# EAGLE design memtester (EAGLE 9.6.2)
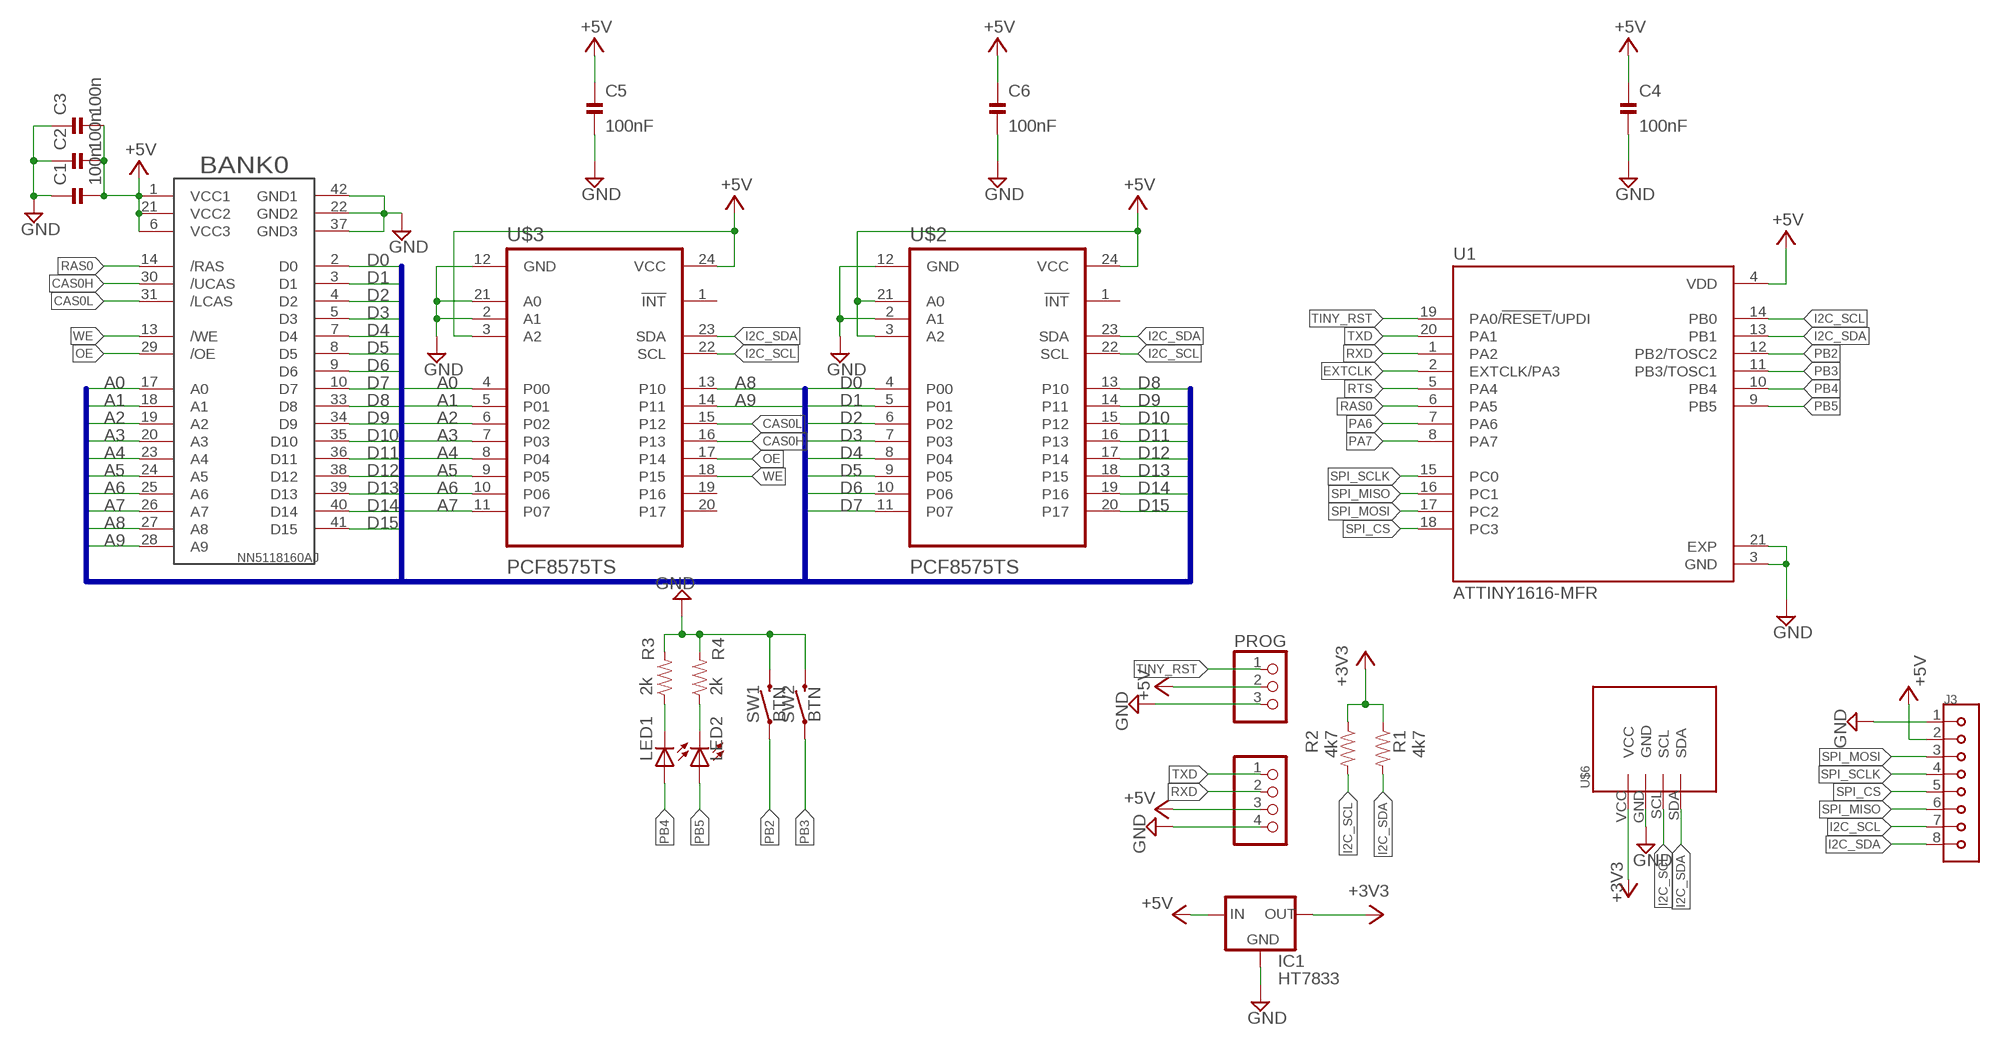
[diagram p0: schematic, sheet 1]

## Parts
C1  100n  CAPACITOR0402_CAP  [0402_CAP]
C2  100n  CAPACITOR0402_CAP  [0402_CAP]
C3  100n  CAPACITOR0402_CAP  [0402_CAP]
C4  100nF  CAPACITOR0402_CAP  [0402_CAP]
C5  100nF  CAPACITOR0402_CAP  [0402_CAP]
C6  100nF  CAPACITOR0402_CAP  [0402_CAP]
IC1  HT7833  HT7333  [SOT-89]
J3  SM08B-SRSS-TB(LF)(SN)  [JST_SM08B-SRSS-TB(LF)(SN)]
LED1  green  LEDCHIP-LED0805  [CHIP-LED0805]
LED2  green  LEDCHIP-LED0805  [CHIP-LED0805]
PROG  PINHD-1X3  [1X03]
R1  4k7  RESISTOR0402_RES  [0402_RES]
R2  4k7  RESISTOR0402_RES  [0402_RES]
R3  2k  RESISTOR0402_RES  [0402_RES]
R4  2k  RESISTOR0402_RES  [0402_RES]
SW1  BTN  MOMENTARY-SWITCH-SPST-SMD-6.0X3.5MM  [TACTILE_SWITCH_SMD_6.0X3.5MM]
SW2  BTN  MOMENTARY-SWITCH-SPST-SMD-6.0X3.5MM  [TACTILE_SWITCH_SMD_6.0X3.5MM]
U1  ATTINY1616-MFR  [QFN40P300X300X90-21N]
U$1  NN5118160AJSOCKET  [SOJ42SOCKET]
U$2  PCF8575TS  [SSOP24]
U$3  PCF8575TS  [SSOP24]
U$6  OLED_0.96_I2CNO_DRILL  [OLED_0.96_I2C_NO_DRILL]
UART  PINHD-1X4  [1X04]

## Nets
+3V3: IC1.1(OUT) R1.1 R2.1 U$6.VCC
+5V: C1.2 C2.2 C3.2 C4.1 C5.1 C6.1 IC1.3(IN) IC1.4(IN) J3.2 PROG.2 U1.4(VDD) U$1.1(VCC1) U$1.6(VCC3) U$1.21(VCC2) U$2.3(A2) U$2.21(A0) U$2.24(VCC) U$3.3(A2) U$3.24(VCC) UART.3
A0: U$1.17(A0) U$3.4(P00)
A1: U$1.18(A1) U$3.5(P01)
A2: U$1.19(A2) U$3.6(P02)
A3: U$1.20(A3) U$3.7(P03)
A4: U$1.23(A4) U$3.8(P04)
A5: U$1.24(A5) U$3.9(P05)
A6: U$1.25(A6) U$3.10(P06)
A7: U$1.26(A7) U$3.11(P07)
A8: U$1.27(A8) U$3.13(P10)
A9: U$1.28(A9) U$3.14(P11)
CAS0H: U$1.30(/UCAS) U$3.16(P13)
CAS0L: U$1.31(/LCAS) U$3.15(P12)
D0: U$1.2(D0) U$2.4(P00)
D1: U$1.3(D1) U$2.5(P01)
D2: U$1.4(D2) U$2.6(P02)
D3: U$1.5(D3) U$2.7(P03)
D4: U$1.7(D4) U$2.8(P04)
D5: U$1.8(D5) U$2.9(P05)
D6: U$1.9(D6) U$2.10(P06)
D7: U$1.10(D7) U$2.11(P07)
D8: U$1.33(D8) U$2.13(P10)
D9: U$1.34(D9) U$2.14(P11)
D10: U$1.35(D10) U$2.15(P12)
D11: U$1.36(D11) U$2.16(P13)
D12: U$1.38(D12) U$2.17(P14)
D13: U$1.39(D13) U$2.18(P15)
D14: U$1.40(D14) U$2.19(P16)
D15: U$1.41(D15) U$2.20(P17)
EXTCLK: U1.2(EXTCLK/PA3)
GND: C1.1 C2.1 C3.1 C4.2 C5.2 C6.2 IC1.2(GND) J3.1 PROG.3 R3.2 R4.2 SW1.2 SW2.2 U1.3(GND) U1.21(EXP) U$1.22(GND2) U$1.37(GND3) U$1.42(GND1) U$2.2(A1) U$2.12(GND) U$3.2(A1) U$3.12(GND) U$3.21(A0) U$6.GND UART.4
I2C_SCL: J3.7 R2.2 U1.14(PB0) U$2.22(SCL) U$3.22(SCL) U$6.SCL
I2C_SDA: J3.8 R1.2 U1.13(PB1) U$2.23(SDA) U$3.23(SDA) U$6.SDA
N$2: LED1.C R3.1
N$3: LED2.C R4.1
OE: U$1.29(/OE) U$3.17(P14)
PA6: U1.7(PA6)
PA7: U1.8(PA7)
PB2: SW1.1 U1.12(PB2/TOSC2)
PB3: SW2.1 U1.11(PB3/TOSC1)
PB4: LED1.A U1.10(PB4)
PB5: LED2.A U1.9(PB5)
RAS0: U1.6(PA5) U$1.14(/RAS)
RTS: U1.5(PA4)
RXD: U1.1(PA2) UART.2
SPI_CS: J3.5 U1.18(PC3)
SPI_MISO: J3.6 U1.16(PC1)
SPI_MOSI: J3.3 U1.17(PC2)
SPI_SCLK: J3.4 U1.15(PC0)
TINY_RST: PROG.1 U1.19(PA0/!RESET!/UPDI)
TXD: U1.20(PA1) UART.1
WE: U$1.13(/WE) U$3.18(P15)
Unconnected: U$2.1(!INT) U$3.1(!INT) U$3.19(P16) U$3.20(P17)

## Buses
A0,A1,A2,A3,A4,A5,A6,A7,A8,A9,D0,D1,D2,D3,D4,D5,D6,D7,D8,D9,D10,D11,D12,D13,D14,D15

## Notes on the sheet
- BANK0

## Library data of the parts
C1-C6 = passives:CAPACITOR: SMD Capacitor
IC1 = holtek2:HT73*; LCSC_PART: C50936
J3 = SM08B-SRSS-TB_LF__SN_:SM08B-SRSS-TB(LF)(SN): SH Series 8 Position 1 mm Pitch Surface Mount Side Entry Shrouded Header Check availability <https://pricing.snapeda.com/parts/SM08B-SRSS-TB%28LF%29%28SN%29/JST%20Sales/view-part?ref=eda>; AVAILABILITY: In Stock; DESCRIPTION: Connector Header Surface Mount, Right Angle 8 position 0.039 (1.00mm); LCSC_PART: C160407; MF: JST Sales; MP: SM08B-SRSS-TB(LF)(SN); PACKAGE: None; PRICE: None; PURCHASE-URL: https://pricing.snapeda.com/search/part/SM08B-SRSS-TB(LF)(SN)/?ref=eda
LED1 LED2 = led:LED: LED OSRAM: - CHIPLED LG R971, LG N971, LY N971, LG Q971, LY Q971, LO R971, LY R971 LH N974, LH R974 LS Q976, LO Q976, LY Q976 LO Q996 - Hyper CHIPLED LW Q18S LB Q993, LB Q99A, LB R99A - SideLED LS A670, LO A670, LY A670, LG A670, LP A670 LB A673, LV A673, LT A673, LW A673 LH A674 LY A675 LS A676, LA A676, LO A676, LY A676, LW A676 LS A679, LY A679, LG A679 - Hyper Micro SIDELED® LS Y876, LA Y876, LO Y876, LY Y876 LT Y87S - SmartLED LW L88C, LW L88S LB L89C, LB L89S, LG L890 LS L89K, LO L89K, LY L89K LS L896, LA L896, LO L896, LY L896 - TOPLED LS T670, LO T670, LY T670, LG T670, LP T670 LSG T670, LSP T670, LSY T670, LOP T670, LYG T670 LG T671, LOG T671, LSG T671 LB T673, LV T673, LT T673, LW T673 LH T674 LS T676, LA T676, LO T676, LY T676, LB T676, LH T676, LSB T676, LW T676 LB T67C, LV T67C, LT T67C, LS T67K, LO T67K, LY T67K, LW E67C LS E67B, LA E67B, LO E67B, LY E67B, LB E67C, LV E67C, LT E67C LW T67C LS T679, LY T679, LG T679 LS T770, LO T770, LY T770, LG T770, LP T770 LB T773, LV T773, LT T773, LW T773 LH T774 LS E675, LA E675, LY E675, LS T675 LS T776, LA T776, LO T776, LY T776, LB T776 LHGB T686 LT T68C, LB T68C - Hyper Mini TOPLED® LB M676 - Mini TOPLED Santana® LG M470 LS M47K, LO M47K, LY M47K Source: http://www.osram.convergy.de LUXEON: - LUMILED® LXK2-PW12-R00, LXK2-PW12-S00, LXK2-PW14-U00, LXK2-PW14-V00 LXK2-PM12-R00, LXK2-PM12-S00, LXK2-PM14-U00 LXK2-PE12-Q00, LXK2-PE12-R00, LXK2-PE12-S00, LXK2-PE14-T00, LXK2-PE14-U00 LXK2-PB12-K00, LXK2-PB12-L00, LXK2-PB12-M00, LXK2-PB14-N00, LXK2-PB14-P00, LXK2-PB14-Q00 LXK2-PR12-L00, LXK2-PR12-M00, LXK2-PR14-Q00, LXK2-PR14-R00 LXK2-PD12-Q00, LXK2-PD12-R00, LXK2-PD12-S00 LXK2-PH12-R00, LXK2-PH12-S00 LXK2-PL12-P00, LXK2-PL12-Q00, LXK2-PL12-R00 Source: www.luxeon.com KINGBRIGHT: KA-3528ASYC Source: www.kingbright.com; LCSC_PART: C2297
PROG = pinhead:PINHD-1X3: PIN HEADER
R1-R4 = passives:RESISTOR: Resistor Basic schematic elements and footprints for 0201, 0402, 0603, 1206, and PTH resistors.
SW1 SW2 = SparkFun-Switches:MOMENTARY-SWITCH-SPST: Momentary Switch (Pushbutton) - SPST Normally-open (NO) SPST momentary switches (buttons, pushbuttons). Variants PTH-12MM - 12mm square, through-hole Momentary Pushbutton Switch - 12mm Square <https://www.sparkfun.com/products/9190> (COM-09190) PTH-6.0MM, PTH-6.0MM-KIT - 6.0mm square, through-hole Mini Pushbutton Switch <https://www.sparkfun.com/products/97> (COM-00097) KIT package intended for soldering kit's - only one side of pads' copper is exposed. PTH-RIGHT-ANGLE-KIT - Right-angle, through-hole Right Angle Tactile Button <https://www.sparkfun.com/products/10791> - Used on SparkFun BigTime Watch Kit <https://www.sparkfun.com/products/11734> SMD-12MM - 12mm square, surface-mount Tactile Button - SMD (12mm) <https://www.sparkfun.com/products/12993> (COM-12993) Used on SparkFun PicoBoard <https://www.sparkfun.com/products/11888> SMD-4.5MM - 4.5mm Square Trackball Switch Used on SparkFun Blackberry Trackballer Breakout <https://www.sparkfun.com/products/13169> SMD-4.6MMX2.8MM - 4.60mm x 2.80mm, surface mount Used on SparkFun SAMD21 Mini Breakout <https://www.sparkfun.com/products/13664> SMD-5.2MM, SMD-5.2-REDUNDANT - 5.2mm square, surface-mount Mini Pushbutton Switch - SMD <https://www.sparkfun.com/products/8720> (COM-08720) Used on Arduino Pro Mini <https://www.sparkfun.com/products/11114> REDUNDANT package connects both switch circuits together SMD-6.0X3.5MM - 6.0 x 3.5mm, surface mount Momentary Reset Switch SMD <https://www.sparkfun.com/products/8229> (COM-08229) SMD-6.2MM-TALL - 6.2mm square, surface mount Tactile Button - SMD (6mm) <https://www.sparkfun.com/products/12992> Used on SparkFun Digital Sandbox <https://www.sparkfun.com/products/12651> SMD-RIGHT-ANGLE - Right-angle, surface mount Used on SparkFun Block for Intel® Edison - Arduino <https://www.sparkfun.com/products/13036>; LCSC_PART: C118141; PROD_ID: SWCH-00815; SF_SKU: COM-08229
U1 = ATTINY1616-MFR:ATTINY1616-MFR: AVR tinyAVR 1, Functional Safety (FuSa) Microcontroller IC 8-Bit 16MHz 16KB (16K x 8) FLASH 20-VQFN (3x3) Check availability <https://pricing.snapeda.com/parts/ATTINY1616-MFR/Microchip/view-part?ref=eda>; AVAILABILITY: In Stock; DESCRIPTION: AVR tinyAVR™ 1, Functional Safety (FuSa) Microcontroller IC 8-Bit 16MHz 16KB (16K x 8) FLASH 20-VQFN (3x3); MF: Microchip; MP: ATTINY1616-MFR; PACKAGE: VQFN-20 Microchip; PRICE: None; PURCHASE-URL: https://pricing.snapeda.com/search/part/ATTINY1616-MFR/?ref=eda
U$1 = memory:NN5118160AJ
U$2 U$3 = PCF8575TS:PCF8575TS; LCSC_PART: C12251
U$6 = tft_1_8_1_44_oled_0_96:OLED_0.96_I2C
UART = pinhead:PINHD-1X4: PIN HEADER

## Net classes
0 default: width 0.152 mm
1 supply: width 0.635 mm

## Board
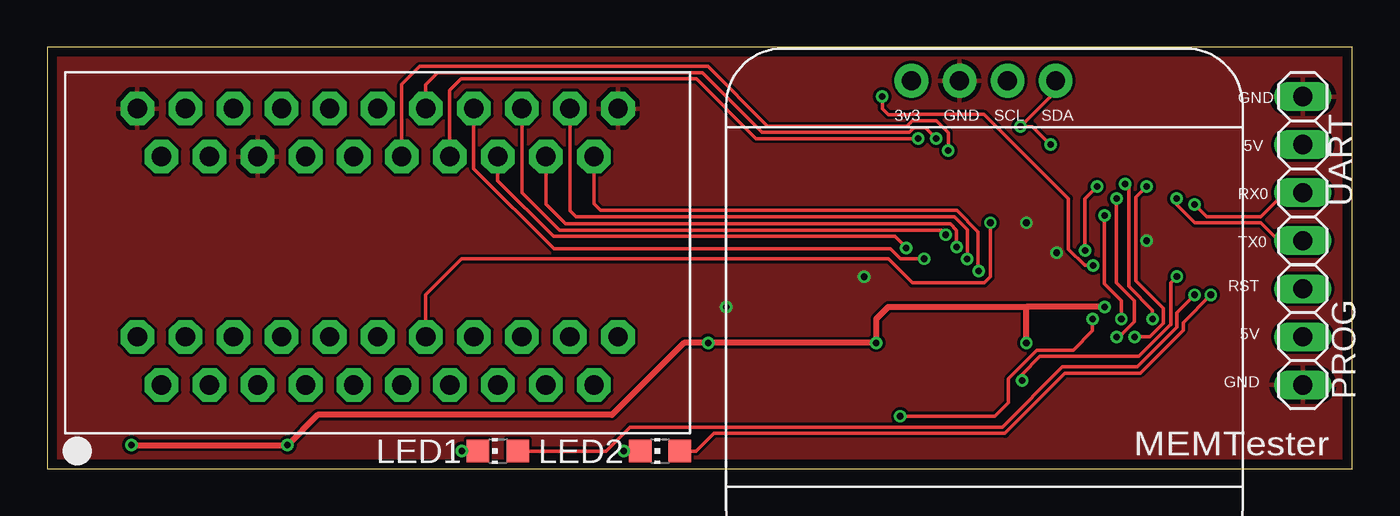
[diagram p1: board, top side]
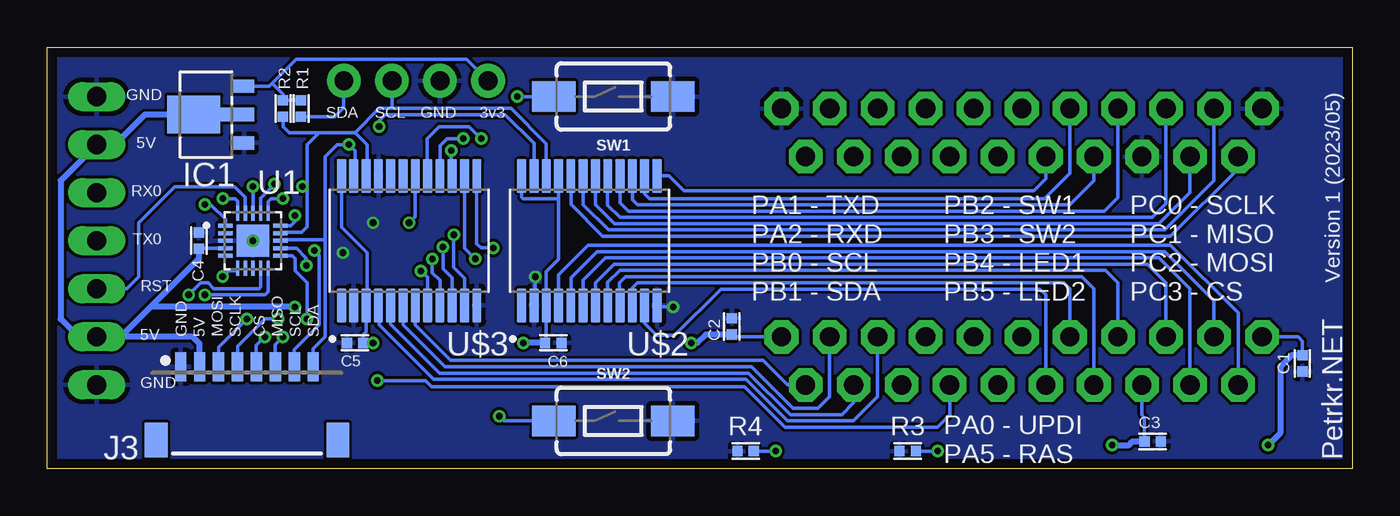
[diagram p2: board, bottom side, seen from below]

Size 68.97 x 22.26 mm. Coordinates in mm from the lower left corner, seen from the top.
Outline: 0,0 68.97,0 68.97,22.26 0,22.26 0,0
Copper layers (1*16): Top 0.035mm / dielectric 1.6mm / Bottom 0.035mm
Design rules "Elecrow_2-layer_PCB_eagle_rule *": minimum track width 7mil, minimum drill 12mil, track to track 6mil, track to pad 6mil, pad to pad 6mil, via to via 8mil, smd to smd 0mil, copper to edge 20mil, drill to drill 10mil, minimum pad ring 6mil, minimum via ring 6mil, stop-mask expansion 0mil, vias tented up to drill 100mil, thermal gap 10mil

### Footprints (pad centres in the part's own frame; a part is rotated, then mirrored left to right if it is on the bottom)
0402_CAP = smd 0.536 x 0.546: 1 -0.433,0; 2 0.433,0
SOT-89 = smd 0.7 x 1.1: 1 1.5,-2.385; 2 -1.5,-2.385 | smd 0.7 x 1.8: 3 0,-2.035 | smd 2 x 2.8: 4 0,0.265
JST_SM08B-SRSS-TB(LF)(SN) = smd 0.6 x 1.55: 1 -3.5,4.775; 2 -2.5,4.775; 3 -1.5,4.775; 4 -0.5,4.775; 5 0.5,4.775; 6 1.5,4.775; 7 2.5,4.775; 8 3.5,4.775 | smd 1.2 x 1.8: P1 -4.8,0.9; P2 4.8,0.9
CHIP-LED0805 = smd 1.2 x 1.2: A 0,-1.05; C 0,1.05
1X03 = drill 1.016 long: 1 -2.54,0; 2 0,0; 3 2.54,0
0402_RES = smd 0.536 x 0.546: 1 -0.433,0; 2 0.433,0
TACTILE_SWITCH_SMD_6.0X3.5MM = smd 2.3 x 1.6: 1 -3.15,0; 2 3.15,0
QFN40P300X300X90-21N = smd 0.81 x 0.22: 1 -1.45,0.8; 2 -1.45,0.4; 3 -1.45,0; 4 -1.45,-0.4; 5 -1.45,-0.8; 11 1.45,-0.8; 12 1.45,-0.4; 13 1.45,0; 14 1.45,0.4; 15 1.45,0.8 | smd 0.22 x 0.81: 6 -0.8,-1.45; 7 -0.4,-1.45; 8 0,-1.45; 9 0.4,-1.45; 10 0.8,-1.45; 16 0.8,1.45; 17 0.4,1.45; 18 0,1.45; 19 -0.4,1.45; 20 -0.8,1.45 | smd 1.7 x 1.7: 21 0,0
SOJ42SOCKET = drill 1.016 pad 1.778 octagon: 1 -12.7,-5.08; 2 -11.43,-7.62; 3 -10.16,-5.08; 4 -8.89,-7.62; 5 -7.62,-5.08; 6 -6.35,-7.62; 7 -5.08,-5.08; 8 -3.81,-7.62; 9 -2.54,-5.08; 10 -1.27,-7.62; 11 0,-5.08; 12 1.27,-7.62; 13 2.54,-5.08; 14 3.81,-7.62; 15 5.08,-5.08; 16 6.35,-7.62; 17 7.62,-5.08; 18 8.89,-7.62; 19 10.16,-5.08; 20 11.43,-7.62; 21 12.7,-5.08; 22 12.7,6.985; 23 11.43,4.445; 24 10.16,6.985; 25 8.89,4.445; 26 7.62,6.985; 27 6.35,4.445; 28 5.08,6.985; 29 3.81,4.445; 30 2.54,6.985; 31 1.27,4.445; 32 0,6.985; 33 -1.27,4.445; 34 -2.54,6.985; 35 -3.81,4.445; 36 -5.08,6.985; 37 -6.35,4.445; 38 -7.62,6.985; 39 -8.89,4.445; 40 -10.16,6.985; 41 -11.43,4.445; 42 -12.7,6.985
SSOP24 = smd 1.78 x 0.48: 1 -3.42,3.575; 2 -3.42,2.925; 3 -3.42,2.275; 4 -3.42,1.625; 5 -3.42,0.975; 6 -3.42,0.325; 7 -3.42,-0.325; 8 -3.42,-0.975; 9 -3.42,-1.625; 10 -3.42,-2.275; 11 -3.42,-2.925; 12 -3.42,-3.575; 13 3.42,-3.575; 14 3.42,-2.925; 15 3.42,-2.275; 16 3.42,-1.625; 17 3.42,-0.975; 18 3.42,-0.325; 19 3.42,0.325; 20 3.42,0.975; 21 3.42,1.625; 22 3.42,2.275; 23 3.42,2.925; 24 3.42,3.575
OLED_0.96_I2C_NO_DRILL = drill 1 pad 1.778: GND -1.63,11.63; SCL 0.91,11.63; SDA 3.45,11.63; VCC -4.17,11.63
1X04 = drill 1.016 long: 1 -3.81,0; 2 -1.27,0; 3 1.27,0; 4 3.81,0

### Placement (x,y rotation side)
C1  2.63,5.56 90 bottom
C2  32.79,7.52 270 bottom
C3  10.54,1.43 180 bottom
C4  60.96,12.04 90 bottom
C5  52.7,6.64 180 bottom
C6  42.23,6.64 0 bottom
IC1  60.96,18.71 90 bottom
J3  58.42,0.61 0 bottom
LED1  23.81,0.93 90 top
LED2  32.38,0.93 90 top
PROG  66.36,6.96 270 top
R1  55.56,19.02 270 bottom
R2  56.52,19.02 270 bottom
R3  23.5,0.93 180 bottom
R4  32.07,0.93 180 bottom
SW1  39.05,19.66 0 bottom
SW2  39.05,2.51 0 bottom
U1  58.1,12.04 0 bottom
U$1  17.46,12.04 0 top
U$2  40.32,12.04 90 bottom
U$3  49.85,12.04 90 bottom
U$6  49.85,8.86 0 top
UART  66.36,15.85 90 top

### Tracks (layer width: path | path; a pad name or v marks a point on that pad's centre or on a via)
+3V3
  Bottom 0.178: U$6.VCC 46.81,21.62 55.82,21.62 57.09,20.35 | R1.1 R2.1 56.52,19.78 57.09,20.35 | 57.09,20.35 57.24,20.21 IC1.1
+5V  (via drill 0.35)
  Top 0.305: v4.45,1.24 v12.7,1.24 14.29,2.83 29.84,2.83 33.66,6.64 v34.92,6.64 v43.81,6.64 43.81,7.91 44.45,8.55 51.75,8.55 | v55.88,8.55 51.75,8.55 | v51.75,6.64 51.75,8.55
  Bottom 0.178: U$2.21 41.95,14.26 | 41.95,14.26 41.95,11.05 42.6,10.4 U$2.3 42.6,6.65 C6.1 | U$2.24 43.9,14.34 43.81,14.26 41.95,14.26 | U$3.24 53.42,12.76 52.07,11.4 52.07,8.67 U$3.3 52.12,7.22 52.27,7.08 C5.1 | U$1.21 32.74,6.96 C2.2 | IC1.3 IC1.4 | C4.1 60.93,11.64 U1.4 | C3.2 10.97,2.69 11.11,2.83 U$1.6 | C1.2 2.63,6.73 2.86,6.96 U$1.1
  Bottom 0.305: C1.2 3.19,5.99 3.81,5.37 3.81,1.88 v4.45,1.24 | v34.92,6.64 34.61,6.64 34.16,7.08 C2.2 | C6.1 v43.81,6.64 | C5.1 v51.75,6.64 | v55.88,8.55 63.5,8.55 | 65.09,6.96 PROG.2 67.31,6.96 68.26,7.91 68.26,15.21 UART.3 65.41,17.12 63.82,18.71 IC1.4 | 63.5,8.55 65.09,6.96 | J3.2 60.92,6.6 61.28,6.96 65.09,6.96 | C4.1 60.96,11.09 63.5,8.55 | C3.2 11.61,1.43 11.8,1.24 v12.7,1.24
A0
  Bottom 0.178: U$1.17 25.08,3.78 26.35,2.51 29.84,2.51 32.04,4.71 48.55,4.71 51.44,7.59 51.44,8.58 U$3.4
A1
  Bottom 0.178: U$1.18 26.35,3.47 26.98,2.84 29.7,2.84 31.9,5.04 48.25,5.04 50.82,7.62 U$3.5
A2
  Bottom 0.178: U$3.6 50.17,7.6 47.94,5.37 31.76,5.37 29.56,3.17 28.23,3.17 27.62,3.78 U$1.19
A3
  Bottom 0.178: U$3.7 49.52,7.59 47.66,5.73 31.15,5.73 29.84,4.42 U$1.20
A4  (via drill 0.35)
  Top 0.178: v49.22,10.45 49.2,10.47 49.2,12.52 48.08,13.64 29.23,13.64 28.89,13.98 U$1.23
  Bottom 0.178: v49.22,10.45 48.87,10.1 U$3.8
A5  (via drill 0.35)
  Top 0.178: v48.63,11.07 48.63,12.62 47.94,13.31 27.94,13.31 27.62,13.63 U$1.24
  Bottom 0.178: v48.63,11.07 48.63,10.35 48.22,9.95 U$3.9
A6  (via drill 0.35)
  Top 0.178: U$1.25 26.35,13.96 27.38,12.93 47.73,12.93 48.06,12.59 v48.06,11.71
  Bottom 0.178: v48.06,11.71 48.06,10.57 47.57,10.08 U$3.10
A7  (via drill 0.35)
  Top 0.178: U$1.26 25.08,14.58 27.07,12.6 47.25,12.6 v47.49,12.36
  Bottom 0.178: v47.49,12.36 47.49,10.64 46.92,10.07 U$3.11
A8  (via drill 0.35)
  Top 0.178: U$1.27 23.81,15.21 26.76,12.27 44.79,12.27 v45.4,11.66
  Bottom 0.178: v45.4,11.66 46.04,11.66 46.27,11.89 U$3.13
A9  (via drill 0.35)
  Top 0.178: U$1.28 22.54,15.85 26.77,11.62 44.55,11.62 45.09,11.09 v46.35,11.09
  Bottom 0.178: v46.35,11.09 46.92,11.65 U$3.14
CAS0H  (via drill 0.35)
  Top 0.178: U$1.30 20,20.28 20.64,20.92 34.62,20.92 37.77,17.77 45.56,17.77 45.8,18.01 46.42,18.01 v46.99,17.44
  Bottom 0.178: U$3.16 48.22,17.05 47.83,17.44 v46.99,17.44
CAS0L  (via drill 0.35)
  Top 0.178: U$1.31 18.73,20.29 19.68,21.25 34.92,21.25 38.08,18.1 45.43,18.1 45.66,18.34 45.67,18.34 45.72,18.39 46.99,18.39 47.62,17.75 v47.62,16.8
  Bottom 0.178: v47.62,16.8 47.62,15.51 U$3.15
D0
  Bottom 0.178: U$1.2 6.03,8.23 9.6,11.8 40.4,11.8 41.95,10.25 U$2.4
D1
  Bottom 0.178: U$2.5 41.3,10.09 39.92,11.47 9.91,11.47 7.3,8.86 U$1.3
D2
  Bottom 0.178: U$1.4 8.57,9.5 10.21,11.14 39.47,11.14 40.65,9.96 U$2.6
D3
  Bottom 0.178: U$2.7 40,9.82 39.01,10.81 10.83,10.81 9.84,9.82 U$1.5
D4
  Bottom 0.178: U$1.7 12.38,9.82 13.04,10.48 38.71,10.48 39.35,9.84 U$2.8
D5
  Bottom 0.178: U$1.8 13.65,9.5 14.3,10.15 38.41,10.15 38.73,9.82 38.73,8.66 U$2.9
D6
  Bottom 0.178: U$1.9 14.92,9.5 15.24,9.82 37.78,9.82 38.05,9.55 U$2.10
D7
  Bottom 0.178: U$2.11 37.4,7.67 36.76,7.03 35.81,7.03 33.35,9.49 16.5,9.49 16.19,9.18 U$1.10
D8
  Bottom 0.178: U$1.33 16.19,15.3 16.83,14.67 35.32,14.67 36.11,15.46 U$2.13
D9
  Bottom 0.178: U$1.34 14.92,15.61 16.27,14.26 37.15,14.26 37.4,14.51 U$2.14
D10
  Bottom 0.178: U$1.35 13.65,15.21 14.94,13.93 37.77,13.93 38.05,14.21 U$2.15
D11
  Bottom 0.178: U$1.36 12.38,14.31 13.09,13.6 38.26,13.6 38.7,14.04 U$2.16
D12
  Bottom 0.178: U$1.38 9.84,13.98 10.55,13.27 38.7,13.27 39.35,13.92 U$2.17
D13
  Bottom 0.178: U$1.39 8.57,14.58 10.21,12.94 39,12.94 40,13.94 U$2.18
D14
  Bottom 0.178: U$1.40 7.3,15.2 9.89,12.61 39.31,12.61 40.65,13.95 U$2.19
D15
  Bottom 0.178: U$2.20 41.3,13.97 39.61,12.28 9.6,12.28 6.03,15.85 U$1.41
GND  (via drill 0.35)
  Bottom 0.178: U$2.12 36.67,8.55 v35.88,8.55 | U$2.2 43.18,8.69 v43.18,10.13
  other vias: 53.34,11.4 51.75,12.99 58.1,12.04
  pour Bottom: 0.15,21.98 68.41,21.98 68.41,0.08 0.15,0.08
  pour Top: 0.15,21.98 68.73,21.98 68.73,0.08 0.15,0.08
I2C_SCL  (via drill 0.35)
  Top 0.178: v54.85,11.52 54.85,14.27 v55.48,14.9
  Bottom 0.178: U1.14 56.6,12.49 55.53,12.49 55.24,12.77 55.24,14.9 | 55.24,14.9 55.24,17.12 54.61,17.75 | 52.7,17.75 52.07,17.12 52.07,15.51 U$3.22 | U$2.22 42.6,17.17 44.46,19.04 50.76,19.04 | 52.7,17.75 51.42,19.04 50.76,19.04 | 52.7,17.75 54.61,17.75 | U$6.SCL 50.76,19.04 | J3.7 55.92,6.28 54.62,7.59 54.62,11.28 v54.85,11.52 | v55.48,14.9 55.24,14.9 | R2.2 56.52,18.07 56.2,17.75 54.61,17.75
I2C_SDA  (via drill 0.35)
  Top 0.178: v53.02,17.12 52.07,18.07 v51.44,18.07 53.3,19.93 U$6.SDA
  Bottom 0.178: U1.13 56.6,12.09 54.28,12.09 | U$3.23 52.7,15.53 52.7,16.8 v53.02,17.12 53.65,17.12 54.28,16.48 54.28,12.09 | U$2.23 43.25,17.19 44.77,18.71 51.12,18.71 51.44,18.39 v51.44,18.07 | J3.8 54.92,6.34 54.28,6.97 54.28,12.09 | R1.2 53.77,18.59 53.3,19.07 U$6.SDA
N$2  (via drill 0.35)
  Top 0.178: v21.91,0.93 LED1.C
  Bottom 0.178: R3.1 v21.91,0.93
N$3  (via drill 0.35)
  Top 0.178: v30.48,0.93 LED2.C
  Bottom 0.178: R4.1 v30.48,0.93
OE  (via drill 0.35)
  Top 0.178: U$1.29 21.27,19.98 21.88,20.59 34.31,20.59 37.47,17.44 v46.04,17.44
  Bottom 0.178: v46.04,17.44 46.67,18.07 48.26,18.07 48.9,17.43 48.9,15.49 U$3.17
PB2  (via drill 0.35)
  Top 0.178: v55.28,10.73 54.84,10.73 53.98,11.59 53.98,14.26 49.52,18.72 45.58,18.72 45.57,18.71 44.45,18.71 44.13,19.02 v44.13,19.66
  Bottom 0.178: U1.12 55.8,11.64 55.28,11.12 v55.28,10.73 | v44.13,19.66 SW1.1
PB3  (via drill 0.35)
  Top 0.178: v55.24,7.91 55.24,7.28 54.22,6.25 52.32,6.25 50.8,4.74 50.8,3.47 50.1,2.77 v45.09,2.77
  Bottom 0.178: U1.11 56.03,11.24 55.88,11.09 55.88,10.45 55.24,9.82 v55.24,7.91 | v45.09,2.77 44.83,2.51 SW2.1
PB4  (via drill 0.35)
  Top 0.178: v60.64,9.18 59.7,8.24 59.7,7.46 57.62,5.37 53.66,5.37 50.48,2.2 30.8,2.2 29.53,0.93 LED1.A
  Bottom 0.178: U1.10 57.3,9.35 57.47,9.18 v60.64,9.18
PB5  (via drill 0.35)
  Top 0.178: v61.5,9.18 60.03,7.71 60.03,7.32 60.01,7.29 60.01,7.28 57.77,5.04 53.79,5.04 50.62,1.87 35.23,1.87 34.29,0.93 LED2.A
  Bottom 0.178: U1.9 57.7,9.59 57.78,9.51 60.17,9.51 60.47,9.82 60.87,9.82 v61.5,9.18
RAS0  (via drill 0.35)
  Top 0.178: v51.52,4.65 51.52,4.97 52.47,5.92 57.7,5.92 59.32,7.54 59.37,7.59 59.37,9.82 v59.7,10.15
  Bottom 0.178: U$1.14 21.27,2.83 21.92,2.18 29.98,2.18 32.13,4.33 48.66,4.33 48.98,4.65 v51.52,4.65 | U1.6 58.9,10.46 59.38,10.46 v59.7,10.15
RXD  (via drill 0.35)
  Top 0.178: UART.2 65.41,14.58 64.14,13.31 61.28,13.31 v60.64,13.94
  Bottom 0.178: U1.1 59.55,13.17 60.33,13.94 v60.64,13.94
SPI_CS  (via drill 0.35)
  Top 0.178: v57.47,6.96 58.27,6.96 58.99,7.68 58.99,8.47 57.53,9.92 57.53,14.33 v58.1,14.9
  Bottom 0.178: U1.18 58.1,14.73 58.17,14.79 58.17,14.9 v58.1,14.9 | v57.47,6.96 57.92,6.51 J3.5
SPI_MISO  (via drill 0.35)
  Top 0.178: v56.52,14.26 56.52,9.82 57.47,8.86 57.47,7.76 56.66,6.96 v56.52,6.96
  Bottom 0.178: J3.6 56.92,6.55 v56.52,6.96 | U1.16 57.3,14.11 57.15,14.26 v56.52,14.26
SPI_MOSI  (via drill 0.35)
  Top 0.178: v56.96,15.03 57.16,14.83 57.16,9.64 58.42,8.38 v58.42,7.91
  Bottom 0.178: U1.17 57.7,14.29 v56.96,15.03 | v58.42,7.91 59.92,6.41 J3.3
SPI_SCLK  (via drill 0.35)
  Top 0.178: v56.77,7.91 56.77,8.86 55.88,9.76 v55.88,13.37
  Bottom 0.178: U1.15 56.1,12.84 55.88,13.06 v55.88,13.37 | v56.77,7.91 57.47,7.91 58.92,6.46 J3.4
TINY_RST
  Bottom 0.178: U1.19 58.5,14.34 59.05,14.9 62.23,14.9 64.14,12.99 64.14,10.13 64.77,9.5 PROG.1
TXD  (via drill 0.35)
  Top 0.178: v59.69,14.26 59.69,13.94 60.66,12.98 64.15,12.98 65.09,12.04 UART.1
  Bottom 0.178: U1.20 58.9,14.12 59.04,14.26 v59.69,14.26
WE  (via drill 0.35)
  Top 0.178: U$1.13 20,9.18 21.91,11.09 44.45,11.09 45.72,9.82 49.53,9.82 49.85,10.13 v49.85,12.99
  Bottom 0.178: v49.85,12.99 49.52,13.32 U$3.18

### Text on the board
tNames: GND | 3v3 | GND | SCL | SDA | 5V | RX0 | TX0 | RST | 5V | GND | MEMTester
bNames: GND | 3v3 | GND | SCL | SDA | 5V | RX0 | TX0 | Version 1 (2023/05) | RST | PC0 - SCLK / PC1 - MISO / PC2 - MOSI / PC3 - CS | PB2 - SW1 / PB3 - SW2 / PB4 - LED1 / PB5 - LED2 | PA1 - TXD / PA2 - RXD / PB0 - SCL / PB1 - SDA | Petrkr.NET | SDA | SCL | MISO | CS | SCLK | MOSI | 5V | GND | 5V | GND | PA0 - UPDI / PA5 - RAS